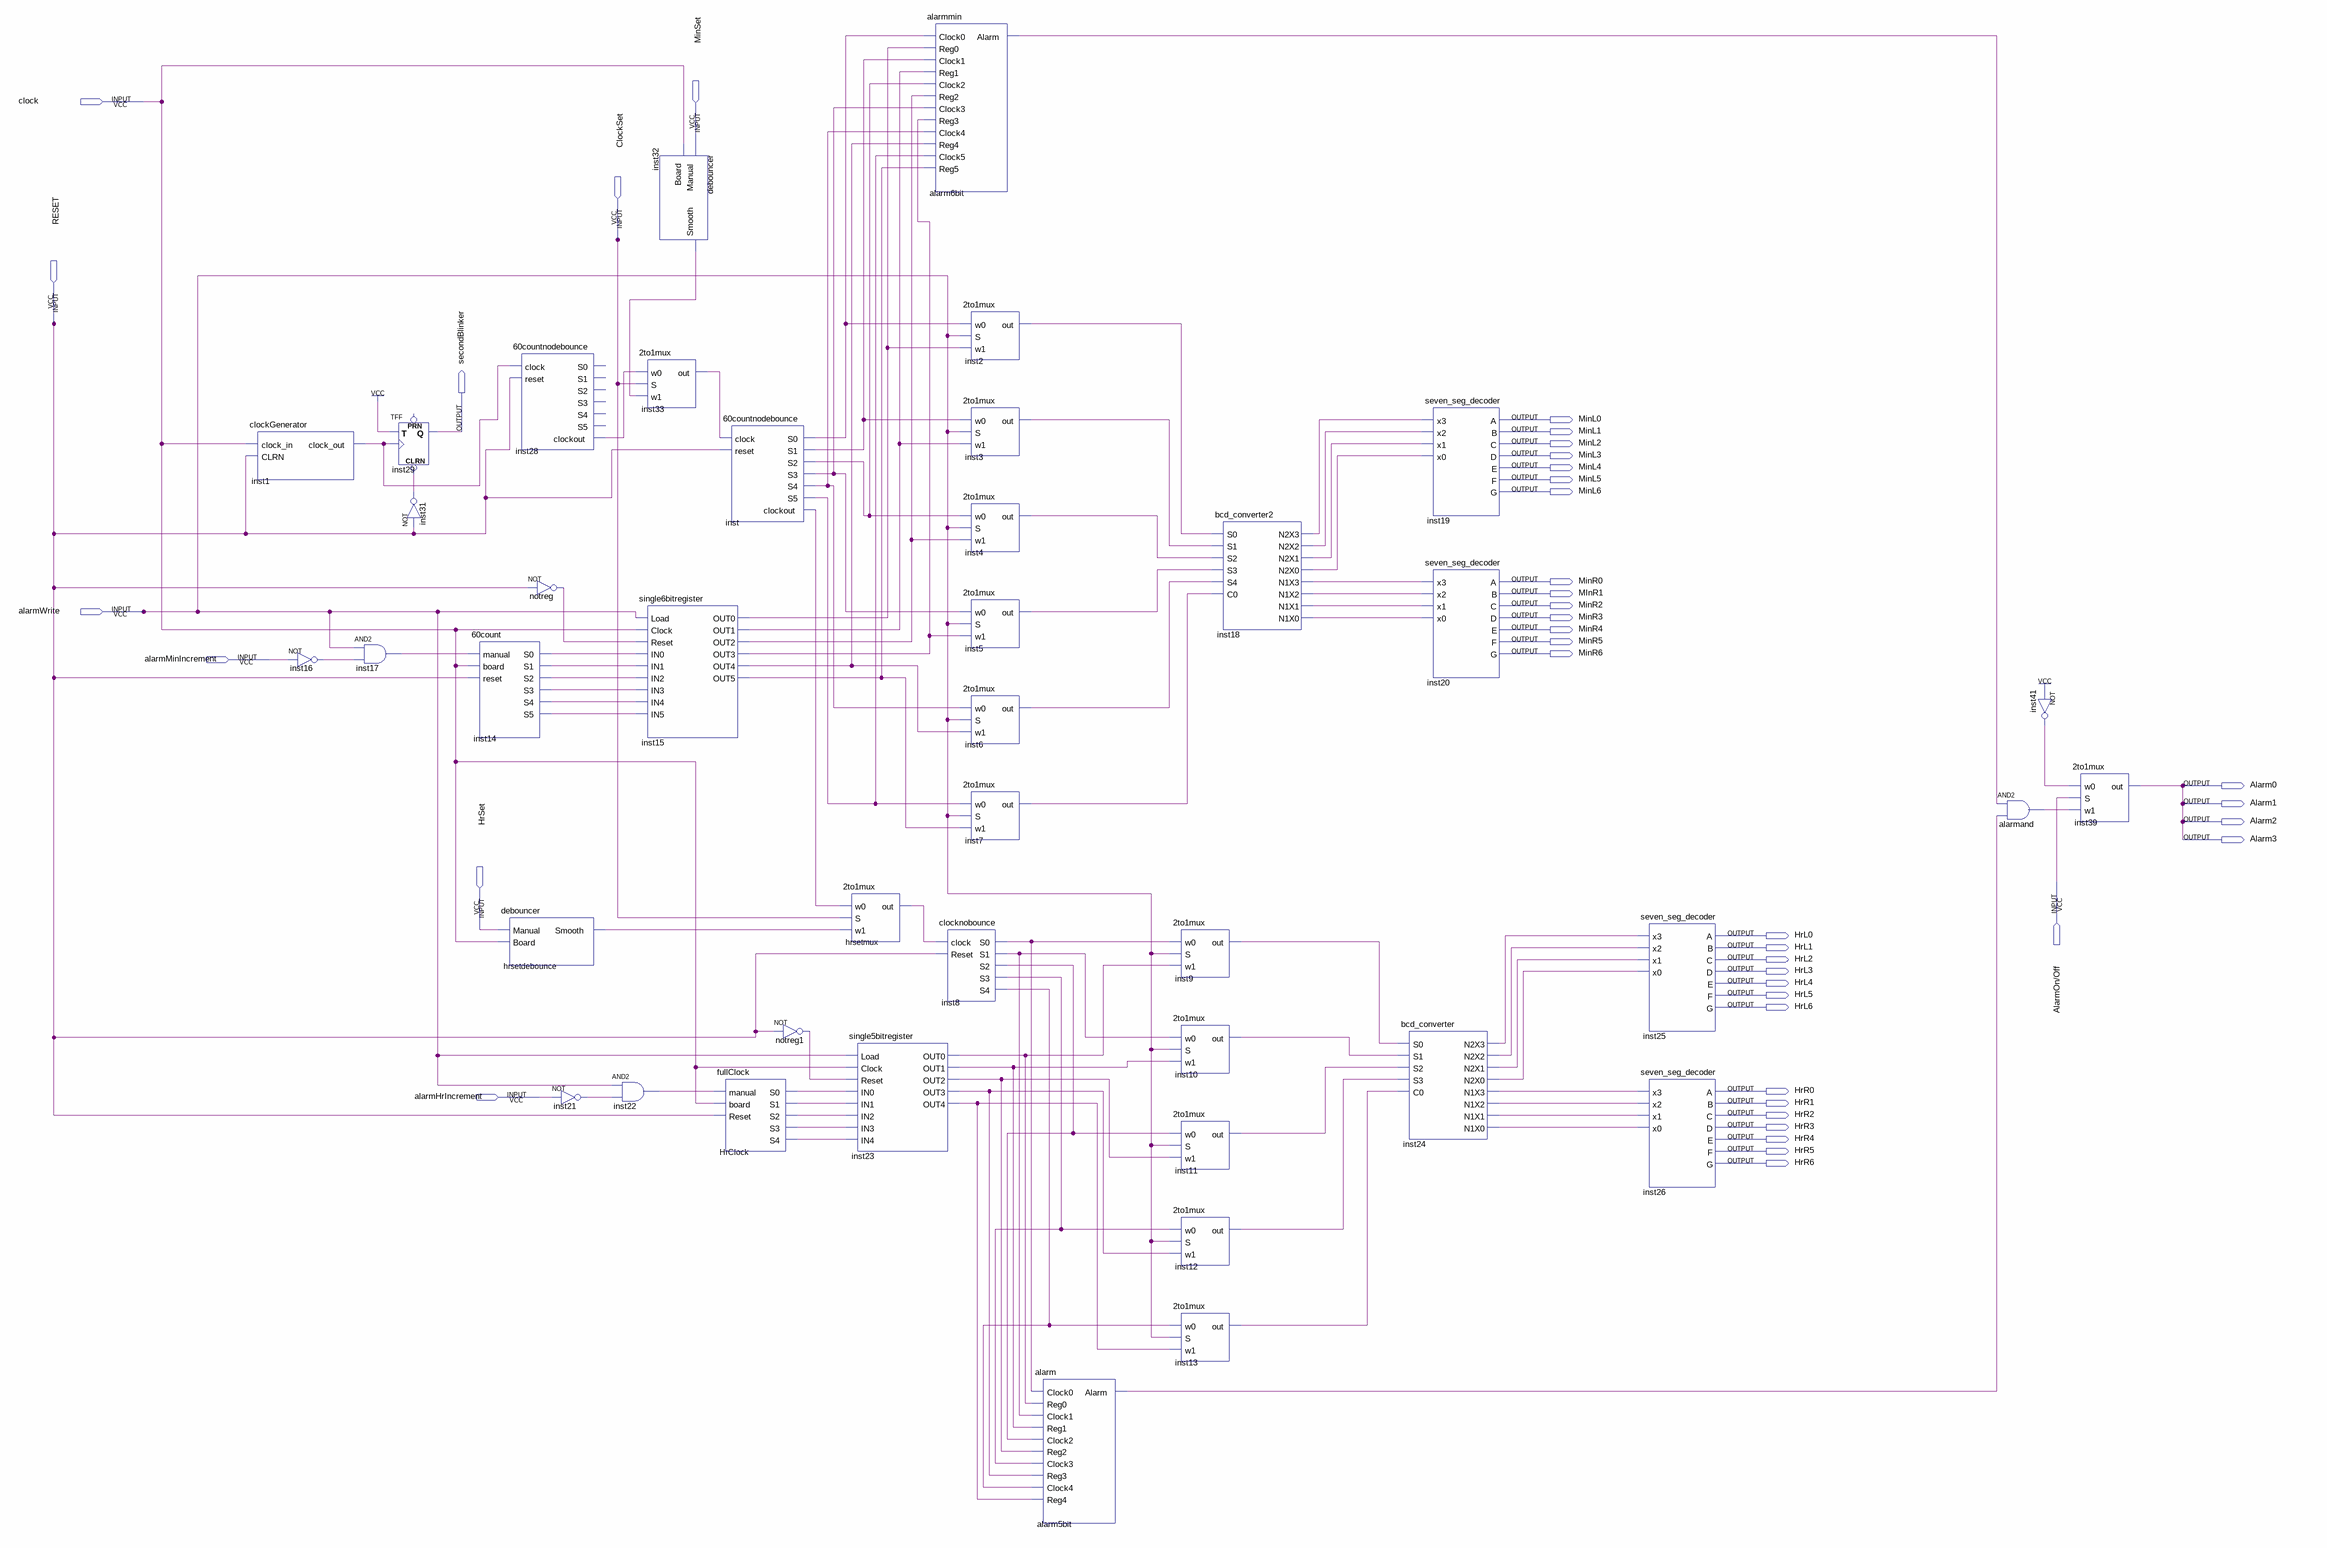
[diagram p0: schematic sheet]
// Quartus schematic alarmclockfinal.bdf as structural Verilog: 42 symbols, 42 pins
module alarmclockfinal (
  input  clock,
  input  MinSet,
  input  ClockSet,
  input  RESET,
  input  alarmWrite,
  input  alarmMinIncrement,
  input  \AlarmOn/Off ,
  input  HrSet,
  input  alarmHrIncrement,
  output MinL0,
  output secondBlinker,
  output MinL1,
  output MinL2,
  output MinL3,
  output MinL4,
  output MinL5,
  output MinL6,
  output MinR0,
  output MInR1,
  output MinR2,
  output MinR3,
  output MinR4,
  output MinR5,
  output MinR6,
  output Alarm0,
  output Alarm1,
  output Alarm2,
  output Alarm3,
  output HrL0,
  output HrL1,
  output HrL2,
  output HrL3,
  output HrL4,
  output HrL5,
  output HrL6,
  output HrR0,
  output HrR1,
  output HrR2,
  output HrR3,
  output HrR4,
  output HrR5,
  output HrR6
);

  wire alarm5bit_alarm, alarm6bit_alarm, alarmand_out, HrClock_s0, HrClock_s1, HrClock_s2, HrClock_s3,
       HrClock_s4, hrsetdebounce_smooth, hrsetmux_out, inst1_clock_out, inst2_out, inst3_out, inst4_out,
       inst5_out, inst6_out, inst7_out, inst8_s0, inst8_s1, inst8_s2, inst8_s3, inst8_s4, inst9_out,
       inst10_out, inst11_out, inst12_out, inst13_out, inst14_s0, inst14_s1, inst14_s2, inst14_s3, inst14_s4,
       inst14_s5, inst15_out0, inst15_out1, inst15_out2, inst15_out3, inst15_out4, inst15_out5, inst16_out,
       inst17_out, inst18_n1x0, inst18_n1x1, inst18_n1x2, inst18_n1x3, inst18_n2x0, inst18_n2x1, inst18_n2x2,
       inst18_n2x3, inst21_out, inst22_out, inst23_out0, inst23_out1, inst23_out2, inst23_out3, inst23_out4,
       inst24_n1x0, inst24_n1x1, inst24_n1x2, inst24_n1x3, inst24_n2x0, inst24_n2x1, inst24_n2x2,
       inst24_n2x3, inst28_clockout, inst31_out, inst32_smooth, inst33_out, inst41_out, inst_clockout,
       inst_s0, inst_s1, inst_s2, inst_s3, inst_s4, inst_s5, notreg1_out, notreg_out;

  clockGenerator inst1 (.clock_in(clock), .CLRN(RESET), .clock_out(inst1_clock_out));
  not inst16 (inst16_out, alarmMinIncrement);
  and inst17 (inst17_out, alarmWrite, inst16_out);
  TFF inst29 (.CLRN(inst31_out), .T(1'b1), .CLK(inst1_clock_out), .Q(secondBlinker));  // open: PRN
  not inst31 (inst31_out, RESET);
  \60count  inst14 (
    .manual(inst17_out), .board(clock), .reset(RESET), .S0(inst14_s0), .S1(inst14_s1), .S2(inst14_s2),
    .S3(inst14_s3), .S4(inst14_s4), .S5(inst14_s5));
  \60countnodebounce  inst28 (
    .clock(inst1_clock_out), .reset(RESET), .clockout(inst28_clockout));  // open: S0, S1, S2, S3, S4, S5
  debouncer hrsetdebounce (.Manual(HrSet), .Board(clock), .Smooth(hrsetdebounce_smooth));
  not notreg (notreg_out, RESET);
  not inst21 (inst21_out, alarmHrIncrement);
  and inst22 (inst22_out, alarmWrite, inst21_out);
  debouncer inst32 (.Manual(MinSet), .Board(clock), .Smooth(inst32_smooth));
  \2to1mux  inst33 (.w0(inst28_clockout), .S(ClockSet), .w1(inst32_smooth), .out(inst33_out));
  single6bitregister inst15 (
    .Load(alarmWrite), .Clock(clock), .Reset(notreg_out), .IN0(inst14_s0), .IN1(inst14_s1), .IN2(inst14_s2),
    .IN3(inst14_s3), .IN4(inst14_s4), .IN5(inst14_s5), .OUT0(inst15_out0), .OUT1(inst15_out1),
    .OUT2(inst15_out2), .OUT3(inst15_out3), .OUT4(inst15_out4), .OUT5(inst15_out5));
  \60countnodebounce  inst (
    .clock(inst33_out), .reset(RESET), .S0(inst_s0), .S1(inst_s1), .S2(inst_s2), .S3(inst_s3), .S4(inst_s4),
    .S5(inst_s5), .clockout(inst_clockout));
  fullClock HrClock (
    .manual(inst22_out), .board(clock), .Reset(RESET), .S0(HrClock_s0), .S1(HrClock_s1), .S2(HrClock_s2),
    .S3(HrClock_s3), .S4(HrClock_s4));
  not notreg1 (notreg1_out, RESET);
  \2to1mux  hrsetmux (.w0(inst_clockout), .S(ClockSet), .w1(hrsetdebounce_smooth), .out(hrsetmux_out));
  single5bitregister inst23 (
    .Load(alarmWrite), .Clock(clock), .Reset(notreg1_out), .IN0(HrClock_s0), .IN1(HrClock_s1),
    .IN2(HrClock_s2), .IN3(HrClock_s3), .IN4(HrClock_s4), .OUT0(inst23_out0), .OUT1(inst23_out1),
    .OUT2(inst23_out2), .OUT3(inst23_out3), .OUT4(inst23_out4));
  alarmmin alarm6bit (
    .Clock0(inst_s0), .Reg0(inst15_out0), .Clock1(inst_s1), .Reg1(inst15_out1), .Clock2(inst_s2),
    .Reg2(inst15_out2), .Clock3(inst_s3), .Reg3(inst15_out3), .Clock4(inst_s4), .Reg4(inst15_out4),
    .Clock5(inst_s5), .Reg5(inst15_out5), .Alarm(alarm6bit_alarm));
  clocknobounce inst8 (
    .clock(hrsetmux_out), .Reset(RESET), .S0(inst8_s0), .S1(inst8_s1), .S2(inst8_s2), .S3(inst8_s3),
    .S4(inst8_s4));
  \2to1mux  inst2 (.w0(inst_s0), .S(alarmWrite), .w1(inst15_out0), .out(inst2_out));
  \2to1mux  inst3 (.w0(inst_s1), .S(alarmWrite), .w1(inst15_out1), .out(inst3_out));
  \2to1mux  inst4 (.w0(inst_s2), .S(alarmWrite), .w1(inst15_out2), .out(inst4_out));
  \2to1mux  inst5 (.w0(inst_s3), .S(alarmWrite), .w1(inst15_out3), .out(inst5_out));
  \2to1mux  inst6 (.w0(inst_s4), .S(alarmWrite), .w1(inst15_out4), .out(inst6_out));
  \2to1mux  inst7 (.w0(inst_s5), .S(alarmWrite), .w1(inst15_out5), .out(inst7_out));
  alarm alarm5bit (
    .Clock0(inst8_s0), .Reg0(inst23_out0), .Clock1(inst8_s1), .Reg1(inst23_out1), .Clock2(inst8_s2),
    .Reg2(inst23_out2), .Clock3(inst8_s3), .Reg3(inst23_out3), .Clock4(inst8_s4), .Reg4(inst23_out4),
    .Alarm(alarm5bit_alarm));
  \2to1mux  inst9 (.w0(inst8_s0), .S(alarmWrite), .w1(inst23_out0), .out(inst9_out));
  \2to1mux  inst10 (.w0(inst8_s1), .S(alarmWrite), .w1(inst23_out1), .out(inst10_out));
  \2to1mux  inst11 (.w0(inst8_s2), .S(alarmWrite), .w1(inst23_out2), .out(inst11_out));
  \2to1mux  inst12 (.w0(inst8_s3), .S(alarmWrite), .w1(inst23_out3), .out(inst12_out));
  \2to1mux  inst13 (.w0(inst8_s4), .S(alarmWrite), .w1(inst23_out4), .out(inst13_out));
  bcd_converter2 inst18 (
    .S0(inst2_out), .S1(inst3_out), .S2(inst4_out), .S3(inst5_out), .S4(inst6_out), .C0(inst7_out),
    .N2X3(inst18_n2x3), .N2X2(inst18_n2x2), .N2X1(inst18_n2x1), .N2X0(inst18_n2x0), .N1X3(inst18_n1x3),
    .N1X2(inst18_n1x2), .N1X1(inst18_n1x1), .N1X0(inst18_n1x0));
  seven_seg_decoder inst19 (
    .x3(inst18_n2x3), .x2(inst18_n2x2), .x1(inst18_n2x1), .x0(inst18_n2x0), .A(MinL0), .B(MinL1), .C(MinL2),
    .D(MinL3), .E(MinL4), .F(MinL5), .G(MinL6));
  seven_seg_decoder inst20 (
    .x3(inst18_n1x3), .x2(inst18_n1x2), .x1(inst18_n1x1), .x0(inst18_n1x0), .A(MinR0), .B(MInR1), .C(MinR2),
    .D(MinR3), .E(MinR4), .F(MinR5), .G(MinR6));
  bcd_converter inst24 (
    .S0(inst9_out), .S1(inst10_out), .S2(inst11_out), .S3(inst12_out), .C0(inst13_out), .N2X3(inst24_n2x3),
    .N2X2(inst24_n2x2), .N2X1(inst24_n2x1), .N2X0(inst24_n2x0), .N1X3(inst24_n1x3), .N1X2(inst24_n1x2),
    .N1X1(inst24_n1x1), .N1X0(inst24_n1x0));
  seven_seg_decoder inst25 (
    .x3(inst24_n2x3), .x2(inst24_n2x2), .x1(inst24_n2x1), .x0(inst24_n2x0), .A(HrL0), .B(HrL1), .C(HrL2),
    .D(HrL3), .E(HrL4), .F(HrL5), .G(HrL6));
  seven_seg_decoder inst26 (
    .x3(inst24_n1x3), .x2(inst24_n1x2), .x1(inst24_n1x1), .x0(inst24_n1x0), .A(HrR0), .B(HrR1), .C(HrR2),
    .D(HrR3), .E(HrR4), .F(HrR5), .G(HrR6));
  and alarmand (alarmand_out, alarm6bit_alarm, alarm5bit_alarm);
  not inst41 (inst41_out, 1'b1);
  \2to1mux  inst39 (.w0(inst41_out), .S(\AlarmOn/Off ), .w1(alarmand_out), .out(Alarm0));

  assign Alarm1 = Alarm0;
  assign Alarm2 = Alarm0;
  assign Alarm3 = Alarm0;
endmodule
